# Altium schematic sheet Power.SchDoc
size A4
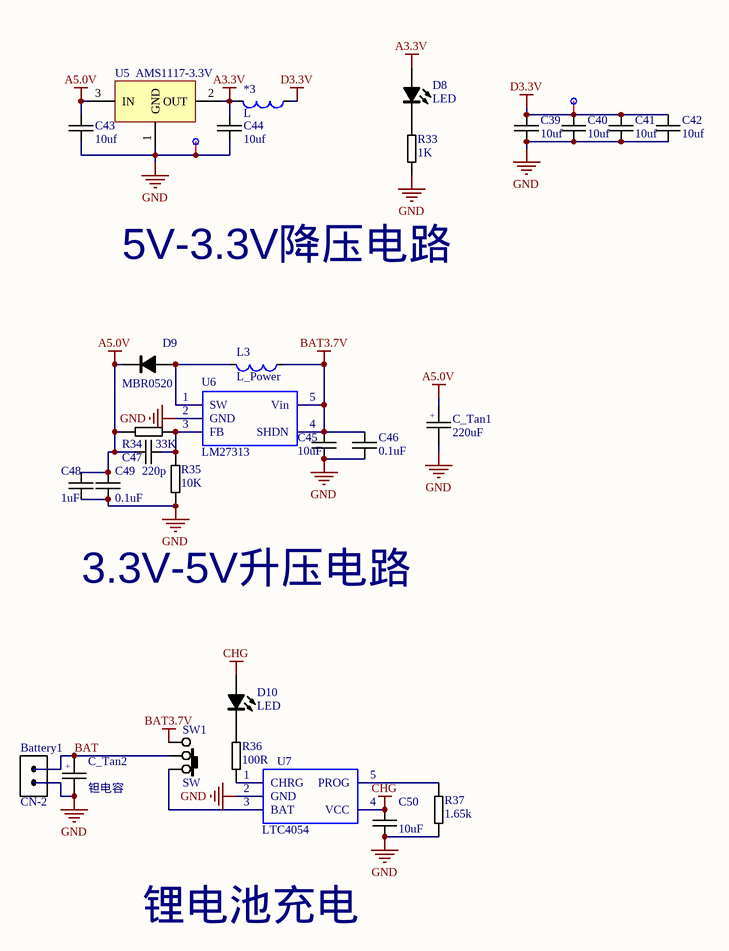
[diagram p0: Power.SchDoc]

## Parts
*3  L  [0603]
*4  Point  [Point]  (value not drawn)
*5  Point  [Point]  (value not drawn)
Battery1  CN-2  [SIP-2]
C39  10uf  [0805-C]
C40  10uf  [0805-C]
C41  10uf  [0805-C]
C42  10uf  [0805-C]
C43  10uf  [0805-C]
C44  10uf  [0805-C]
C45  10uF  [0603]
C46  0.1uF  [0603]
C47  220p  [0603]
C48  1uF  [0603]
C49  0.1uF  [0603]
C50  10uF  [0603]
C_Tan1  220uF  [钽电容7343]
C_Tan2  钽电容  [钽电容7343]
D8  LED  [0805-LED]
D9  MBR0520  [SOD-123-L]
D10  LED  [0603]
L3  L_Power  [GDSD3316]
R33  1K  [0805-R]
R34  33K  [0603]
R35  10K  [0603]
R36  100R  [0603]
R37  1.65k  [0603]
SW1  SW  [SW-SPDT(12.5×6,3)]
U5  AMS1117-3.3V  [SOT-223]
U6  LM27313  [DBV005_L]
U7  LTC4054  [DBV005_L]

## Nets
A3.3V: *3.1 C44.1 D8.1(A) U5.2(OUT)
A5.0V: C43.1 C47.1 C48.1 C49.1 C_Tan1.2 D9.2(K) R34.1 U5.3(IN)
BAT3.7V: C45.1 C46.1 L3.2 SW1.3 U6.4(SHDN) U6.5(Vin)
CHG: C50.1 D10.1(A) U7.4(VCC)
D3.3V: *3.2 *4.1(Point) C39.1 C40.1 C41.1 C42.1
GND: *5.1(Point) Battery1.2 C39.2 C40.2 C41.2 C42.2 C43.2 C44.2 C45.2 C46.2 C48.2 C49.2 C50.2 C_Tan1.1 C_Tan2.1 R33.2 R35.2 R37.2 U5.1(GND) U6.2(GND) U7.2(GND)
BAT: Battery1.1 C_Tan2.2 SW1.2
NetC47_2: C47.2 R34.2 R35.1 U6.3(FB)
NetD8_2: D8.2(K) R33.1
NetD9_1: D9.1(A) L3.1 U6.1(SW)
NetD10_2: D10.2(K) R36.1
NetR36_2: R36.2 U7.1(CHRG)
NetR37_1: R37.1 U7.5(PROG)
NetSW1_1: SW1.1 U7.3(BAT)

## Notes on the sheet
- 5V-3.3V降压电路
- 3.3V-5V升压电路
- 锂电池充电
- (in symbol 钽电容) +

## Library data of the parts
C39-C50 = CAP_Chip: 贴片
C_Tan1 = 钽电容
D8 D10 = LED: 贴片
D9 = MBR0520: 贴片
R33-R37 = RES_Chip: 贴片
SW1 = SW-SPDT(拨动开关,12.5×6×11): 1.09.07.0005
U5 = AMS1117